# Altium schematic sheet 1_uC.SchDoc
size 414 x 293 mm; SheetNumber: 1; SheetTotal: 4
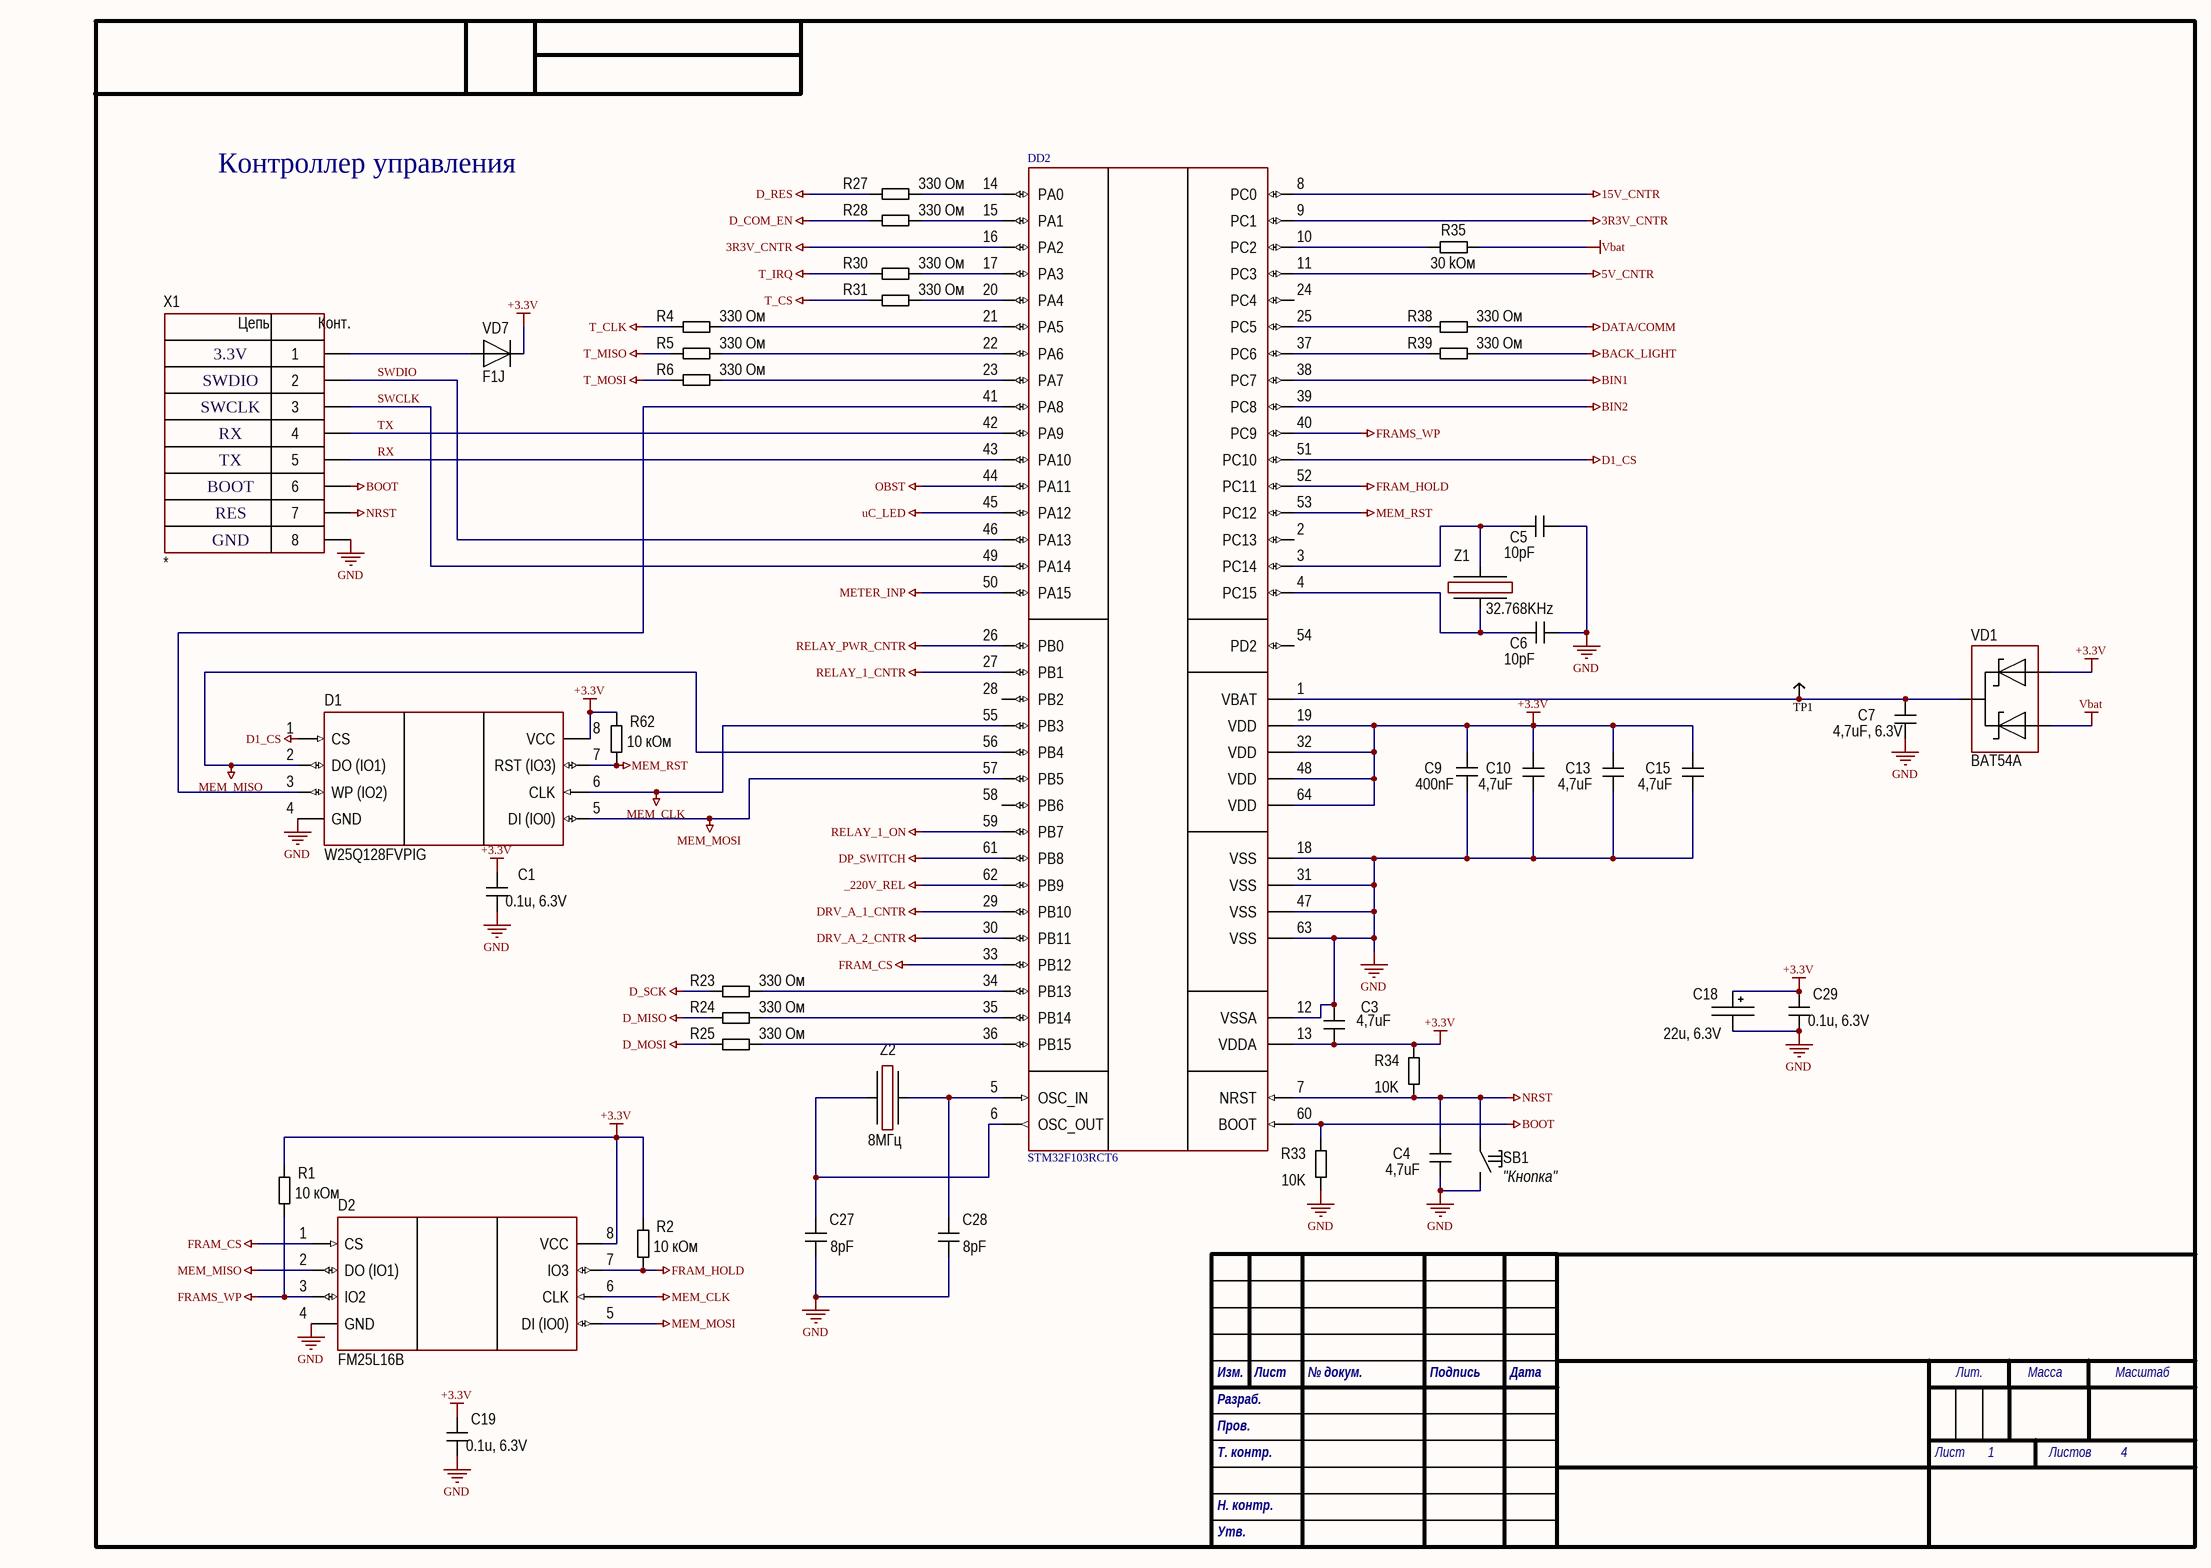
[diagram p0: 1_uC.SchDoc]

## Parts
C1  0.1u, 6.3V  [CH0402C]
C3  4,7uF  [CH0402C]
C4  4,7uF  [CH0402C]
C5  10pF  [CH0402C]
C6  10pF  [CH0402C]
C7  4,7uF, 6.3V  [CH0402C]
C9  400nF  [CH0402C]
C10  4,7uF  [CH0402C]
C13  4,7uF  [CH0402C]
C15  4,7uF  [CH0402C]
C18  22u, 6.3V  [TANTAL_A]
C19  0.1u, 6.3V  [CH0402C]
C27  8pF  [CH0402C]
C28  8pF  [CH0402C]
C29  0.1u, 6.3V  [CH0402C]
D1  W25Q128FVPIG  [8-WSON (5x6mm)without_holes]
D2  FM25L16B  [8-SOIC]
DD2  STM32F103RCT6  [64-LQFP]
R1  10 кОм  [CH0402R]
R2  10 кОм  [CH0402R]
R4  330 Ом  [CH0402R]
R5  330 Ом  [CH0402R]
R6  330 Ом  [CH0402R]
R23  330 Ом  [CH0402R]
R24  330 Ом  [CH0402R]
R25  330 Ом  [CH0402R]
R27  330 Ом  [CH0402R]
R28  330 Ом  [CH0402R]
R30  330 Ом  [CH0402R]
R31  330 Ом  [CH0402R]
R33  10K  [CH0402R]
R34  10K  [CH0402R]
R35  30 kОм  [CH0402R]
R38  330 Ом  [CH0402R]
R39  330 Ом  [CH0402R]
R62  10 кОм  [CH0402R]
SB1  "Кнопка"  [TL1014BF160QG]
TP1  (no value)  [TestPoint]
VD1  BAT54A  [SOT23_123]
VD7  F1J  [SOD123F]
X1  *  [CON: PBS-8]
Z1  32.768KHz  [OSC: 3215]
Z2  8МГц  [OSC: ABM3]

## Nets
3R3V_CNTR: DD2.9(PC1) DD2.16(PA2)
5V_CNTR: DD2.11(PC3)
15V_CNTR: DD2.8(PC0)
+3.3V: C1.2 C3.1 C9.1 C10.2 C13.2 C15.2 C18.1 C19.2 C29.2 D1.8(VCC) D2.8(VCC) DD2.13(VDDA) DD2.19(VDD) DD2.32(VDD) DD2.48(VDD) DD2.64(VDD) R1.2 R2.2 R34.2 R62.2 VD1.1 VD7.2
_220V_REL: DD2.62(PB9)
BACK_LIGHT: R39.1
BIN1: DD2.38(PC7)
BIN2: DD2.39(PC8)
BOOT: DD2.60(BOOT) R33.2 X1.6
D1_CS: D1.1(CS) DD2.51(PC10)
D_COM_EN: R28.1
D_MISO: R24.1
D_MOSI: R25.1
D_RES: R27.1
D_SCK: R23.1
DATA/COMM: R38.1
DP_SWITCH: DD2.61(PB8)
DRV_A_1_CNTR: DD2.29(PB10)
DRV_A_2_CNTR: DD2.30(PB11)
FRAM_CS: D2.1(CS) DD2.33(PB12)
FRAM_HOLD: D2.7(IO3) DD2.52(PC11) R2.1
FRAMS_WP: D2.3(IO2) DD2.40(PC9) R1.1
GND: C1.1 C3.2 C4.1 C5.2 C6.1 C7.1 C9.2 C10.1 C13.1 C15.1 C18.2 C19.1 C27.1 C28.1 C29.1 D1.4(GND) D2.4(GND) DD2.12(VSSA) DD2.18(VSS) DD2.31(VSS) DD2.47(VSS) DD2.63(VSS) R33.1 SB1.2 X1.8
MEM_CLK: D1.6(CLK) D2.6(CLK) DD2.55(PB3)
MEM_MISO: D1.2(DO_(IO1)) D2.2(DO_(IO1)) DD2.56(PB4)
MEM_MOSI: D1.5(DI_(IO0)) D2.5(DI_(IO0)) DD2.57(PB5)
MEM_RST: D1.7(RST_(IO3)) DD2.53(PC12) R62.1
METER_INP: DD2.50(PA15)
NRST: C4.2 DD2.7(NRST) R34.1 SB1.1 X1.7
OBST: DD2.44(PA11)
RELAY_1_CNTR: DD2.27(PB1)
RELAY_1_ON: DD2.59(PB7)
RELAY_PWR_CNTR: DD2.26(PB0)
T_CLK: R4.1
T_CS: R31.1
T_IRQ: R30.1
T_MISO: R5.1
T_MOSI: R6.1
uC_LED: DD2.45(PA12)
Vbat: R35.1 VD1.3
RX: DD2.43(PA10) X1.5
SWCLK: DD2.49(PA14) X1.3
SWDIO: DD2.46(PA13) X1.2
TX: DD2.42(PA9) X1.4
NetC5_1: C5.1 DD2.3(PC14) Z1.3
NetC6_2: C6.2 DD2.4(PC15) Z1.1
NetC7_2: C7.2 DD2.1(VBAT) TP1.0 VD1.2
NetC27_2: C27.2 DD2.6(OSC_OUT) Z2.1
NetC28_2: C28.2 DD2.5(OSC_IN) Z2.3
NetD1_3: D1.3(WP_(IO2)) DD2.41(PA8)
NetDD2_10: DD2.10(PC2) R35.2
NetDD2_14: DD2.14(PA0) R27.2
NetDD2_15: DD2.15(PA1) R28.2
NetDD2_17: DD2.17(PA3) R30.2
NetDD2_20: DD2.20(PA4) R31.2
NetDD2_21: DD2.21(PA5) R4.2
NetDD2_22: DD2.22(PA6) R5.2
NetDD2_23: DD2.23(PA7) R6.2
NetDD2_25: DD2.25(PC5) R38.2
NetDD2_34: DD2.34(PB13) R23.2
NetDD2_35: DD2.35(PB14) R24.2
NetDD2_36: DD2.36(PB15) R25.2
NetDD2_37: DD2.37(PC6) R39.2
NetVD7_1: VD7.1 X1.1

Not connected (* = marked no-connect by the designer): DD2 2(PC13) 24(PC4) 28(PB2) 54(PD2) 58(PB6)

## Notes on the sheet
- Контроллер управления
- 3.3V
- SWDIO
- SWCLK
- RX
- TX
- BOOT
- RES
- GND
- Изм.
- Лист
- № докум.
- Подпись
- Дата
- Лит.
- Масса
- Масштаб
- Пров.
- Разраб.
- Т. контр.
- Н. контр.
- Листов
- Утв.
- (in symbol 8-Connector) Цепь; Конт.

## Library data of the parts
C1 C7 C19 C29 = Capacitor: Manufacturer: *; Model: *; HelpURL: *; ComponentKind: *; Value: *
C3-C6 C9 C10 C13 C15 C27 C28 = Capacitor: 0402; Manufacturer: *; Model: *; HelpURL: *; ComponentKind: *; Value: *
C18 = TantalCap: Manufacturer: *; Model: *; HelpURL: *; ComponentKind: *; Value: *
D1 = W25Q128FVPIG: Flash; Manufacturer: Winbond Electronics; Model: W25Q128FVPIG; HelpURL: https://www.digikey.com/product-detail/en/winbond-electronics/W25Q128FVPIG/W25Q128FVPIG-ND/4037386; ComponentKind: 8-WSON
D2 = W25Q80JVSSIQ: Flash; Manufacturer: Winbond Electronics; Model: W25Q80JVSSIQ; HelpURL: https://www.digikey.com/product-detail/en/winbond-electronics/W25Q80JVSSIQ/W25Q80JVSSIQ-ND/6193772; ComponentKind: 8-SOIC
DD2 = STM32F103RCT6: Cortex-M3 (64-LQFP)
R1 R2 R4-R6 R23-R25 R27 R28 R30 R31 R35 R38 R39 R62 = Resistor: 0603; Manufacturer: *; Model: *; HelpURL: *; ComponentKind: *; Value: *
R33 R34 = Resistor: 0805; Manufacturer: *; Model: *; HelpURL: *; ComponentKind: *; Value: *
SB1 = Tactile switches: 6x6 mm; Manufacturer: *; Model: *; HelpURL: *; ComponentKind: *
TP1 = TestPoint
VD1 = Diod Schottky Array v.1: SOT-23; ComponentKind: *; Manufacturer: *; Model: *; HelpURL: *
VD7 = Diod: ComponentKind: *; Manufacturer: *; Model: *; HelpURL: *
X1 = 8-Connector: Pin header 8; Model: *; Manufacturer: *; HelpURL: *; ComponentKind: *
Z1 = Oscillator: Manufacturer: *; Model: *; HelpURL: *; ComponentKind: *; Value: *
Z2 = Oscillator: NX5032GA-8MHz; Manufacturer: *; Model: *; HelpURL: *; ComponentKind: *; Value: *